# Altium project project_5.PrjPcb
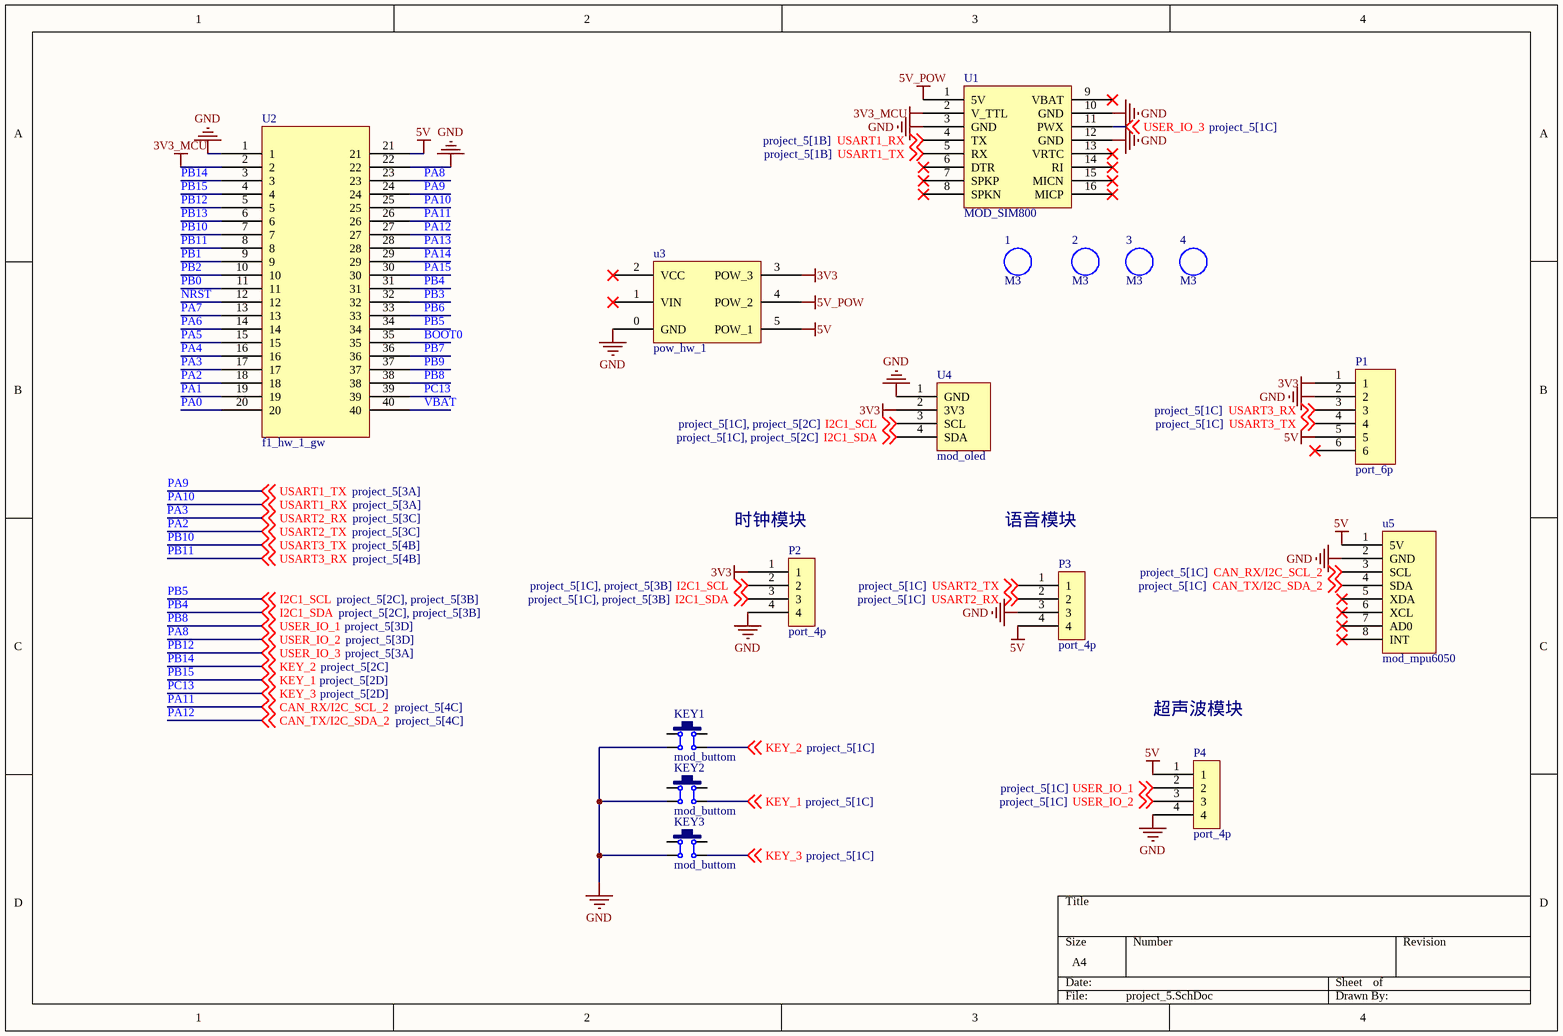
[diagram p0: project_5.SchDoc]
1 sheet, 16 parts. Net scope: global (net labels, ports and power ports of the same name join across sheets).
Board file: project_5.PcbDoc

## Sheet project_5.SchDoc
size A4; SheetNumber: 1; SheetTotal: 1

### Parts
1  M3  [M3 125X200]
2  M3  [M3 125X200]
3  M3  [M3 125X200]
4  M3  [M3 125X200]
KEY1  mod_buttom  [MOD_BUTTOM]
KEY2  mod_buttom  [MOD_BUTTOM]
KEY3  mod_buttom  [MOD_BUTTOM]
P1  port_6p  [MOD_GPS]
P2  port_4p  [MOD_RTC]
P3  port_4p  [MOD_VOICE]
P4  port_4p  [MOD_ECHO]
U1  MOD_SIM800  [MOD_SIM800]
U2  f1_hw_1_gw  [F1_HW_1_GW]
u3  pow_hw_1  [pow_hw_1]
U4  mod_oled  [mod_oled]
u5  mod_mpu6050  [MOD_MPU6050]

### Nets
3V3: P1.1 P2.1 u3.3(POW_3) U4.2(3V3)
3V3_MCU: U1.2(V_TTL) U2.2
5V: P1.5 P3.4 P4.1 U2.21 u3.5(POW_1) u5.1(5V)
5V_POW: U1.1(5V) u3.4(POW_2)
GND: KEY1.4 KEY2.4 KEY3.4 P1.2 P2.4 P3.3 P4.4 U1.3(GND) U1.10(GND) U1.12(GND) U2.1 U2.22 u3.0(GND) U4.1(GND) u5.2(GND)
BOOT0: U2.35
NRST: U2.12
PA0: U2.20
PA1: U2.19
PA2: P3.1 U2.18 ; off-sheet USART2_TX  [also labelled USART2_TX]
PA3: P3.2 U2.17 ; off-sheet USART2_RX  [also labelled USART2_RX]
PA4: U2.16
PA5: U2.15
PA6: U2.14
PA7: U2.13
PA8: P4.3 U2.23 ; off-sheet USER_IO_2  [also labelled USER_IO_2]
PA9: U1.5(RX) U2.24 ; off-sheet USART1_TX  [also labelled USART1_TX]
PA10: U1.4(TX) U2.25 ; off-sheet USART1_RX  [also labelled USART1_RX]
PA11: U2.26 u5.3(SCL) ; off-sheet CAN_RX/I2C_SCL_2  [also labelled CAN_RX/I2C_SCL_2]
PA12: U2.27 u5.4(SDA) ; off-sheet CAN_TX/I2C_SDA_2  [also labelled CAN_TX/I2C_SDA_2]
PA13: U2.28
PA14: U2.29
PA15: U2.30
PB0: U2.11
PB1: U2.9
PB2: U2.10
PB3: U2.32
PB4: P2.3 U2.31 U4.4(SDA) ; off-sheet I2C1_SDA  [also labelled I2C1_SDA]
PB5: P2.2 U2.34 U4.3(SCL) ; off-sheet I2C1_SCL  [also labelled I2C1_SCL]
PB6: U2.33
PB7: U2.36
PB8: P4.2 U2.38 ; off-sheet USER_IO_1  [also labelled USER_IO_1]
PB9: U2.37
PB10: P1.4 U2.7 ; off-sheet USART3_TX  [also labelled USART3_TX]
PB11: P1.3 U2.8 ; off-sheet USART3_RX  [also labelled USART3_RX]
PB12: U1.11(PWX) U2.5 ; off-sheet USER_IO_3  [also labelled USER_IO_3]
PB13: U2.6
PB14: KEY1.3 U2.3 ; off-sheet KEY_2  [also labelled KEY_2]
PB15: KEY2.3 U2.4 ; off-sheet KEY_1  [also labelled KEY_1]
PC13: KEY3.3 U2.39 ; off-sheet KEY_3  [also labelled KEY_3]
VBAT: U2.40

Not connected (* = marked no-connect by the designer): KEY1 1 2; KEY2 1 2; KEY3 1 2; P1 6*; U1 6(DTR)* 7(SPKP)* 8(SPKN)* 9(VBAT)* 13(VRTC)* 14(RI)* 15(MICN)* 16(MICP)*; u3 1(VIN)* 2(VCC)*; u5 5(XDA)* 6(XCL)* 7(AD0)* 8(INT)*

### Notes on the sheet
- (near P2) 时钟模块
- 语音模块
- 超声波模块

### Library data of the parts
1-4 = prot_m3: m3铜柱孔; BOM名称: 铜柱孔; 版权归属: 源创客; 学习资源: www.ooocke.com
KEY1-KEY3 = mod_buttom: 6*6*4.3按键
P1 = port_6p: 6P模块接口
P2-P4 = port_4p: 4P模块接口
U1 = MOD_SIM800: SIM800短信模块
u3 = pow_hw_1: 三路降压电源模块 / 6p排母*2
U4 = mod_oled: oled模块 / 4p排母
u5 = mod_mpu6050: 陀螺仪模块